# EAGLE design 3da (EAGLE 6.6.0)
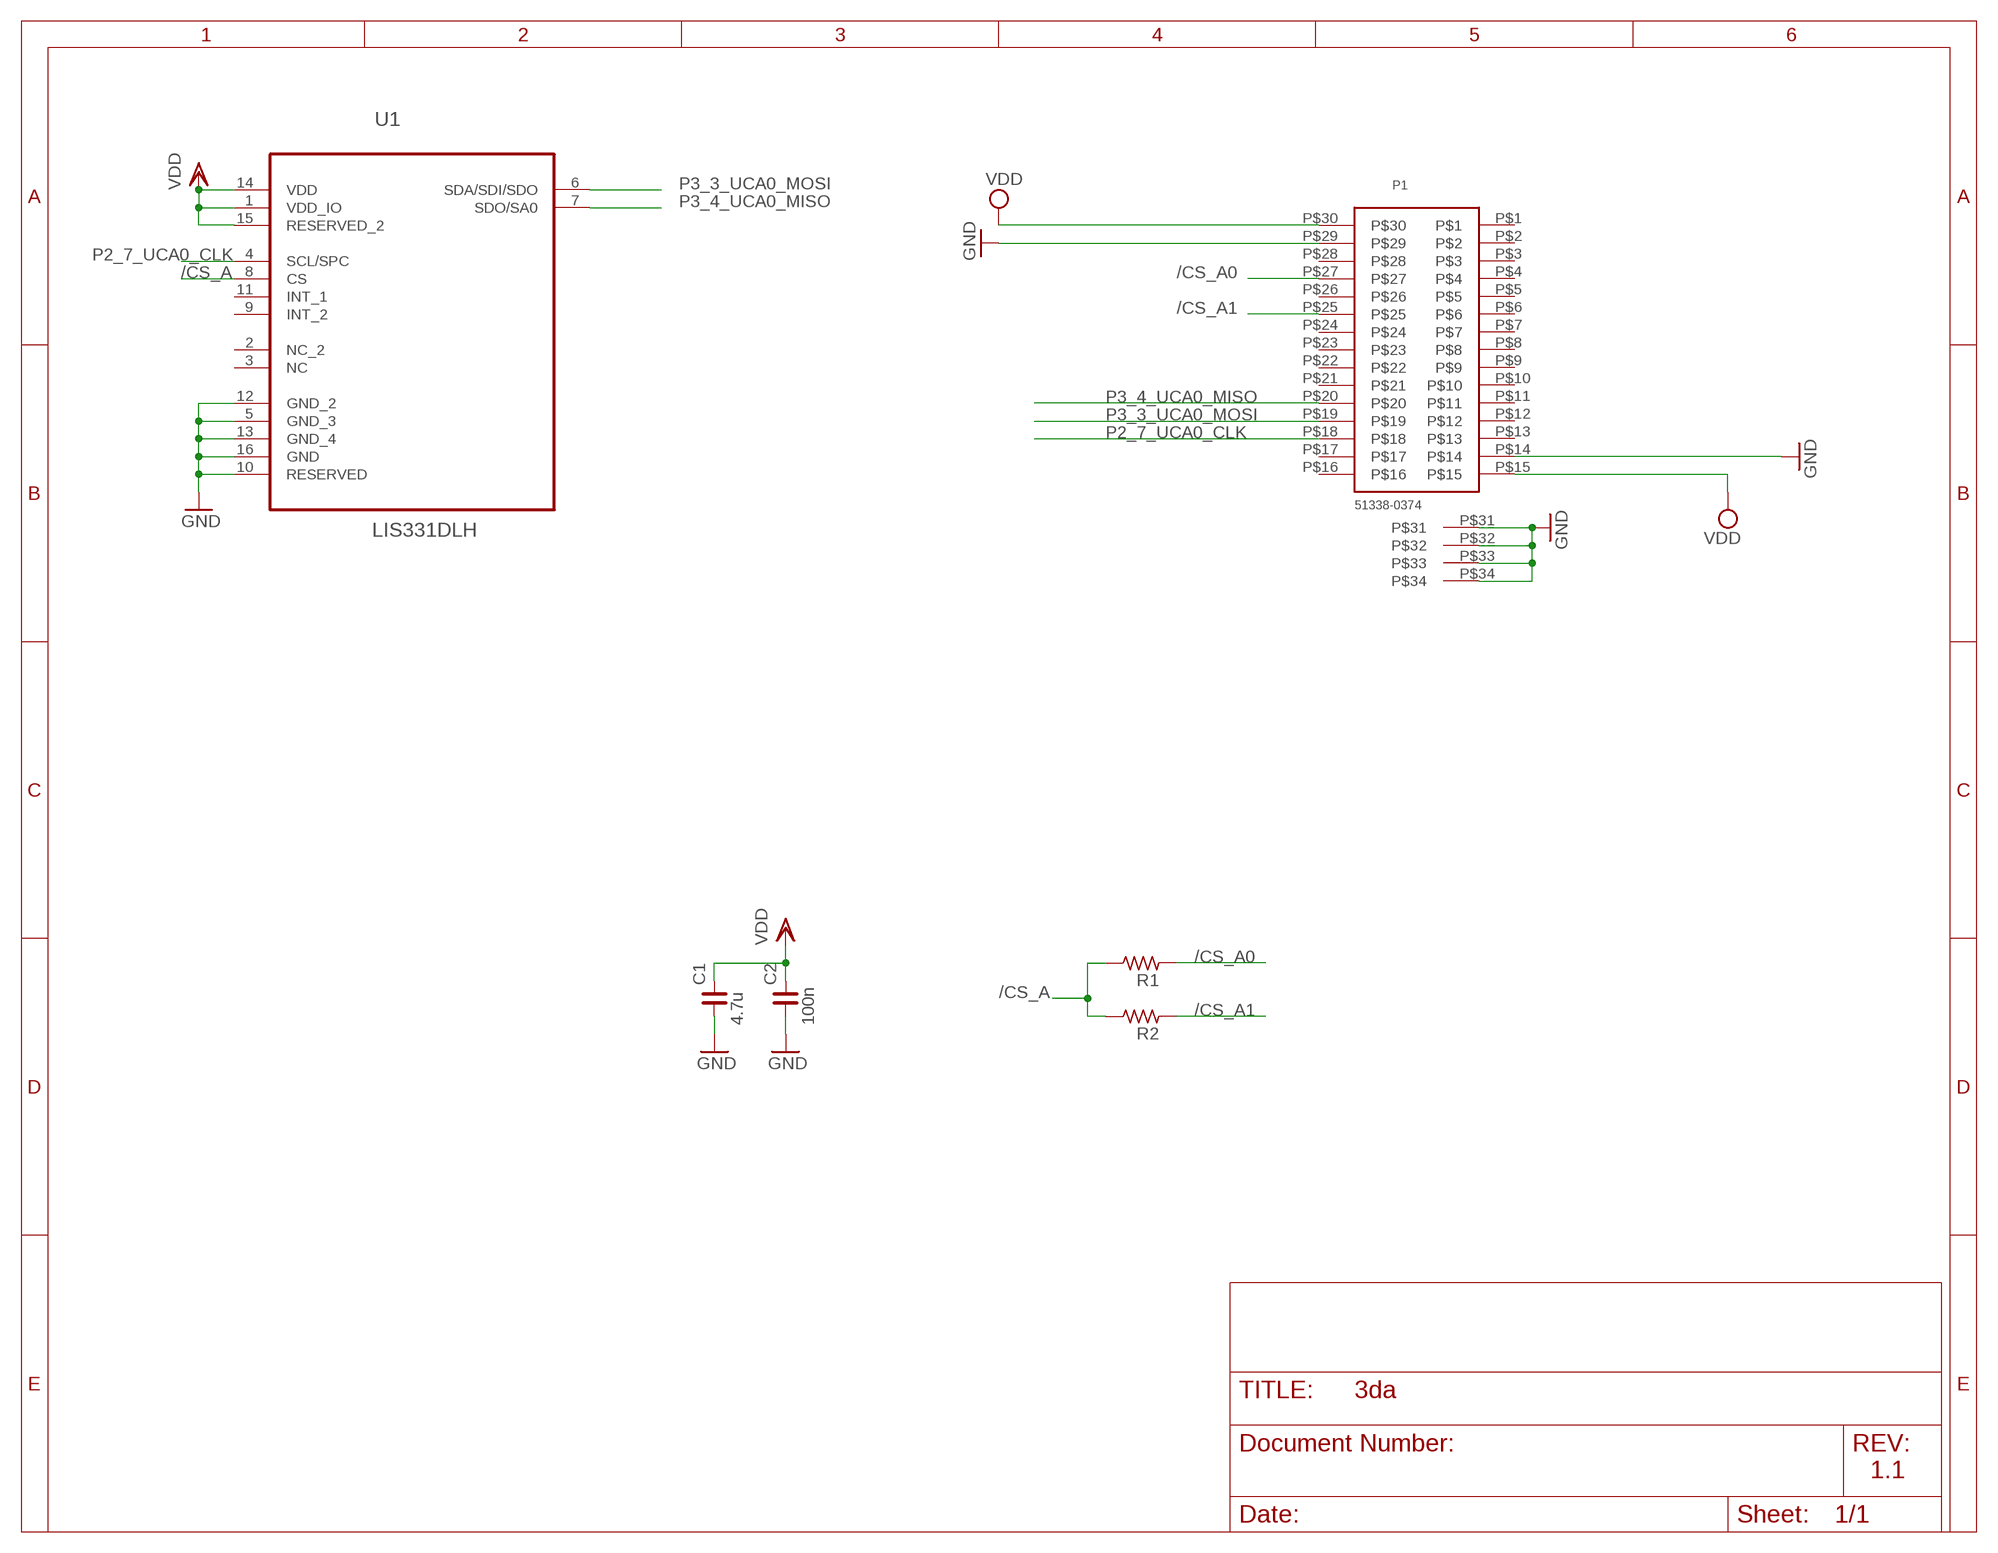
[diagram p0: schematic, sheet 1]

## Parts
C1  4.7u  C_0402  [C0402]
C2  100n  C_0402  [C0402]
P1  51338-0374  51338-0374_RECEPTACLE  [51338-0374_RECEPTACLE]
R1  R_0402  [R0402]
R2  R_0402  [R0402]
U1  LIS331DLH  [LGA16R50P3X5_300X300X100]

## Nets
/CS_A: R1.2 R2.2 U1.8(CS)
/CS_A0: P1.P$27 R1.1
/CS_A1: P1.P$25 R2.1
GND: C1.1 C2.1 P1.P$14 P1.P$29 P1.P$31 P1.P$32 P1.P$33 P1.P$34 U1.5(GND_3) U1.10(RESERVED) U1.12(GND_2) U1.13(GND_4) U1.16(GND)
P2_7_UCA0_CLK: P1.P$18 U1.4(SCL/SPC)
P3_3_UCA0_MOSI: P1.P$19 U1.6(SDA/SDI/SDO)
P3_4_UCA0_MISO: P1.P$20 U1.7(SDO/SA0)
VDD: C1.2 C2.2 P1.P$15 P1.P$30 U1.1(VDD_IO) U1.14(VDD) U1.15(RESERVED_2)
Unconnected: P1.P$1 P1.P$2 P1.P$3 P1.P$4 P1.P$5 P1.P$6 P1.P$7 P1.P$8 P1.P$9 P1.P$10 P1.P$11 P1.P$12 P1.P$13 P1.P$16 P1.P$17 P1.P$21 P1.P$22 P1.P$23 P1.P$24 P1.P$26 P1.P$28 U1.2(NC_2) U1.3(NC) U1.9(INT_2) U1.11(INT_1)

## Notes on the sheet
- 1.1

## Library data of the parts
C1 C2 = rc-master-smd:C_: NON-POLARIZED CAP
P1 = Molex_SlimStack:51338-0374_RECEPTACLE
R1 R2 = rc-master-smd:R_: RESISTOR
U1 = lis331dlh:LIS331DLH: MEMS motion sensor; MPN: LIS331DLH; OC_FARNELL: 1838523; OC_NEWARK: 09R4846; PACKAGE: LGA-16; SUPPLIER: STMicroelectronics

## Board
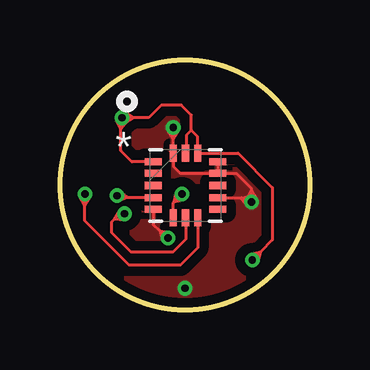
[diagram p1: board, top side]
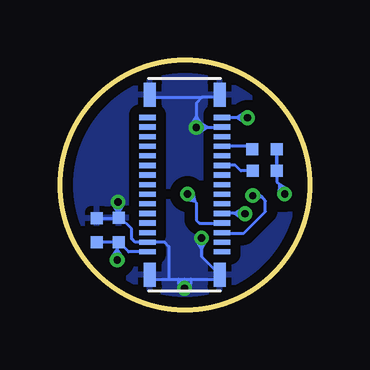
[diagram p2: board, bottom side, seen from below]

Size 10.4 x 10.4 mm. Coordinates in mm from the lower left corner, seen from the top.
Outline: circle at 5.2,5.2 radius 5.2
Copper layers (1*16): Top 0.035mm / dielectric 1.5mm / Bottom 0.035mm
Design rules "DIRTY_PCB": minimum track width 5mil, minimum drill 12mil, track to track 5mil, track to pad 5mil, pad to pad 5mil, via to via 5mil, smd to smd 0mil, copper to edge 10mil, drill to drill 10mil, minimum pad ring 10mil, minimum via ring 6mil, stop-mask expansion 2mil, vias tented up to drill 25mil, thermal gap 10mil

### Footprints (pad centres in the part's own frame; a part is rotated, then mirrored left to right if it is on the bottom)
C0402 = smd 0.5 x 0.5: 1 -0.508,0; 2 0.508,0
51338-0374_RECEPTACLE = smd 0.7 x 0.22: P$1 -1.55,2.8; P$2 -1.55,2.4; P$3 -1.55,2; P$4 -1.55,1.6; P$5 -1.55,1.2; P$6 -1.55,0.8; P$7 -1.55,0.4; P$8 -1.55,0; P$9 -1.55,-0.4; P$10 -1.55,-0.8; P$11 -1.55,-1.2; P$12 -1.55,-1.6; P$13 -1.55,-2; P$14 -1.55,-2.4; P$15 -1.55,-2.8; P$16 1.55,-2.8; P$17 1.55,-2.4; P$18 1.55,-2; P$19 1.55,-1.6; P$20 1.55,-1.2; P$21 1.55,-0.8; P$22 1.55,-0.4; P$23 1.55,0; P$24 1.55,0.4; P$25 1.55,0.8; P$26 1.55,1.2; P$27 1.55,1.6; P$28 1.55,2; P$29 1.55,2.4; P$30 1.55,2.8 | smd 0.5 x 1: P$31 1.45,3.75; P$32 -1.45,3.75; P$33 -1.45,-3.75; P$34 1.45,-3.75
R0402 = smd 0.5 x 0.5: 1 -0.508,0; 2 0.508,0
LGA16R50P3X5_300X300X100 = smd 0.711 x 0.305: 1 -1.346,0.991; 2 -1.346,0.508; 3 -1.346,0; 4 -1.346,-0.508; 5 -1.346,-0.991; 9 1.346,-0.991; 10 1.346,-0.508; 11 1.346,0; 12 1.346,0.508; 13 1.346,0.991 | smd 0.305 x 0.711: 6 -0.508,-1.346; 7 0,-1.346; 8 0.508,-1.346; 14 0.508,1.346; 15 0,1.346; 16 -0.508,1.346

### Placement (x,y rotation side)
C1  8.86,3.3 270 bottom
C2  7.95,3.32 270 bottom
P1  5.2,5.21 0 bottom
R1  1.87,6.67 0 bottom
R2  1.87,5.78 0 bottom
U1  5.23,5.17 0 top

### Tracks (layer width: path | path; a pad name or v marks a point on that pad's centre or on a via)
/CS_A  (via drill 0.3)
  Top 0.127: U1.8 5.73,2.57 5.02,1.85 2.88,1.85 1.04,3.69 1.04,4.36 | 1.04,4.36 v1.04,4.81 | 1.04,4.36 1.24,4.69 v1.04,4.81 | 1.04,4.36 0.83,4.69 v1.04,4.81
  Bottom 0.127: R2.2 R1.2 1.37,6.67 R1.2 1.36,5.32 1.26,5.21 | 1.26,5.21 1.04,4.99 v1.04,4.81 | 1.26,5.21 0.92,5.03 v1.04,4.81 | 1.26,5.21 1.28,4.83 v1.04,4.81
/CS_A0
  Bottom 0.127: R1.1 2.52,6.81 P1.P$27
/CS_A1
  Bottom 0.127: R2.1 2.87,5.78 3.1,6.01 P1.P$25
GND  (via drill 0.3)
  Top 0.127: 4.72,7.13 U1.16 4.72,5.96 5,5.68 U1.12 | 4.72,7.13 v4.72,7.58 | U1.5 3.88,3.54 4.16,3.29 | 4.16,3.29 v4.5,2.99 | U1.10 7.56,4.66 | 7.56,4.66 7.8,4.66 v7.98,4.49 | U1.13 U1.12 | 7.98,4.94 7.98,5.05 7.35,5.68 U1.12 | 7.98,4.94 v7.98,4.49 | 4.72,7.13 4.93,7.46 v4.72,7.58 | 4.72,7.13 4.52,7.46 v4.72,7.58 | 7.56,4.66 7.78,4.35 v7.98,4.49 | 7.56,4.66 7.94,4.73 v7.98,4.49 | 7.98,4.94 7.77,4.61 v7.98,4.49 | 7.98,4.94 8.18,4.61 v7.98,4.49 | 4.16,3.29 4.27,2.92 v4.5,2.99 | 4.16,3.29 4.54,3.22 v4.5,2.99
  Bottom 0.127: C2.1 7.97,3.81 C1.1 8.77,3.9 | C2.1 7.89,3.83 7.42,3.36 7.42,2.94 7.28,2.81 P1.P$14 6.04,2.8 5.86,2.63 5.86,1.31 5.91,1.27 | v4.72,7.58 4.7,7.61 4.26,7.61 | 4.26,7.61 P1.P$29 | P1.P$31 3.87,8.84 4.49,8.84 | 4.49,8.84 4.72,8.6 4.72,8.04 | 4.72,8.04 v4.72,7.58 | 6.6,8.9 P1.P$32 6.65,8.84 4.49,8.84 | 4.5,2.53 4.5,2.2 P1.P$34 3.75,1.27 4.94,1.27 | 4.5,2.53 v4.5,2.99 | 5.91,1.27 6.46,1.27 P1.P$33 6.56,1.46 | 5.91,1.27 5.47,1.27 | 5.47,1.27 5.21,1.27 | 5.21,1.27 4.94,1.27 | C2.1 7.98,3.86 7.98,4.03 | 7.98,4.03 v7.98,4.49 | v5.21,0.89 5.21,1.27 | 4.26,7.61 4.58,7.38 v4.72,7.58 | 4.26,7.61 4.6,7.79 v4.72,7.58 | 4.72,8.04 4.52,7.71 v4.72,7.58 | 4.72,8.04 4.93,7.71 v4.72,7.58 | 7.98,4.03 8.18,4.36 v7.98,4.49 | 7.98,4.03 7.77,4.36 v7.98,4.49 | 4.5,2.53 4.71,2.86 v4.5,2.99 | 4.5,2.53 4.3,2.86 v4.5,2.99 | 5.47,1.27 5.11,1.11 v5.21,0.89 | 5.47,1.27 5.45,0.88 v5.21,0.89 | 4.94,1.27 4.97,0.88 v5.21,0.89 | 4.94,1.27 5.3,1.11 v5.21,0.89
  pour Top (isolate 0.4): 0.2,5.2 arc-90 5.2,10.2 arc-90 10.2,5.2 arc-90 5.2,0.2 arc-91
  pour Bottom (isolate 0.432): 0.2,5.2 arc-90 5.2,10.2 arc-90 10.2,5.2 arc-90 5.2,0.2 arc-91
P2_7_UCA0_CLK  (via drill 0.3)
  Top 0.127: v2.37,4.75 2.81,4.68 | 2.81,4.68 3.86,4.68 arc-90 U1.4 | 2.81,4.68 2.44,4.98 v2.37,4.75 | 2.81,4.68 2.44,4.52 v2.37,4.75
  Bottom 0.127: P1.P$18 3.63,3.18 2.74,3.18 1.85,4.08 1.85,4.52 2.01,4.71 | 2.01,4.71 2.01,4.68 v2.37,4.75 | 2.01,4.71 2.36,4.5 v2.37,4.75 | 2.01,4.71 2.29,4.98 v2.37,4.75
P3_3_UCA0_MOSI  (via drill 0.3)
  Top 0.127: U1.6 4.72,4.45 4.76,4.49 | 4.76,4.49 v5.08,4.81 | 4.76,4.49 5.14,4.58 v5.08,4.81 | 4.76,4.49 4.85,4.87 v5.08,4.81
  Bottom 0.127: v5.08,4.81 4.76,4.49 | 4.76,4.49 4.72,4.45 4.72,3.73 4.6,3.61 P1.P$19 | 4.76,4.49 5.14,4.58 v5.08,4.81 | 4.76,4.49 4.85,4.87 v5.08,4.81
P3_4_UCA0_MISO  (via drill 0.3)
  Top 0.127: U1.7 5.23,2.92 4.71,2.4 2.96,2.4 2.15,3.21 2.15,3.66 2.28,3.79 | 2.28,3.79 2.49,3.99 v2.69,3.99 | 2.28,3.79 2.67,3.75 v2.69,3.99 | 2.28,3.79 2.48,4.12 v2.69,3.99
  Bottom 0.127: v2.69,3.99 2.7,4.01 3.14,4.01 | 3.14,4.01 P1.P$20 | 3.14,4.01 2.81,4.2 v2.69,3.99 | 3.14,4.01 2.82,3.79 v2.69,3.99
VDD  (via drill 0.3)
  Top 0.127: U1.1 3,6.16 2.54,6.62 2.54,7.54 | 2.54,7.54 2.54,7.95 v2.59,8 | U1.15 5.28,6.57 5.28,7.28 5.47,7.47 | 3.04,8 3.7,8 4.22,8.52 5.05,8.52 5.47,8.1 5.47,7.47 | 3.04,8 v2.59,8 | U1.14 5.83,6.61 | U1.14 5.74,7.21 5.47,7.47 | U1.14 7.42,6.52 8.85,5.08 8.85,2.91 8.34,2.39 | 8.34,2.39 v8.01,2.07 | 2.54,7.54 2.78,7.85 v2.59,8 | 2.54,7.54 2.37,7.89 v2.59,8 | 3.04,8 2.72,8.2 v2.59,8 | 3.04,8 2.72,7.79 v2.59,8 | 8.34,2.39 7.96,2.3 v8.01,2.07 | 8.34,2.39 8.25,2.01 v8.01,2.07
  Bottom 0.127: P1.P$15 7.54,2.41 C2.2 | C2.2 8.84,2.82 C1.2 | v2.59,8 3.04,8 | 3.04,8 3.64,8 P1.P$30 | v8.01,2.07 8.01,2.52 | 8.01,2.52 8.01,2.75 C2.2 | 3.04,8 2.72,8.2 v2.59,8 | 3.04,8 2.72,7.79 v2.59,8 | 8.01,2.52 7.81,2.19 v8.01,2.07 | 8.01,2.52 8.22,2.19 v8.01,2.07